# EAGLE board rev01 (EAGLE 7.3.0), part 1 of 2
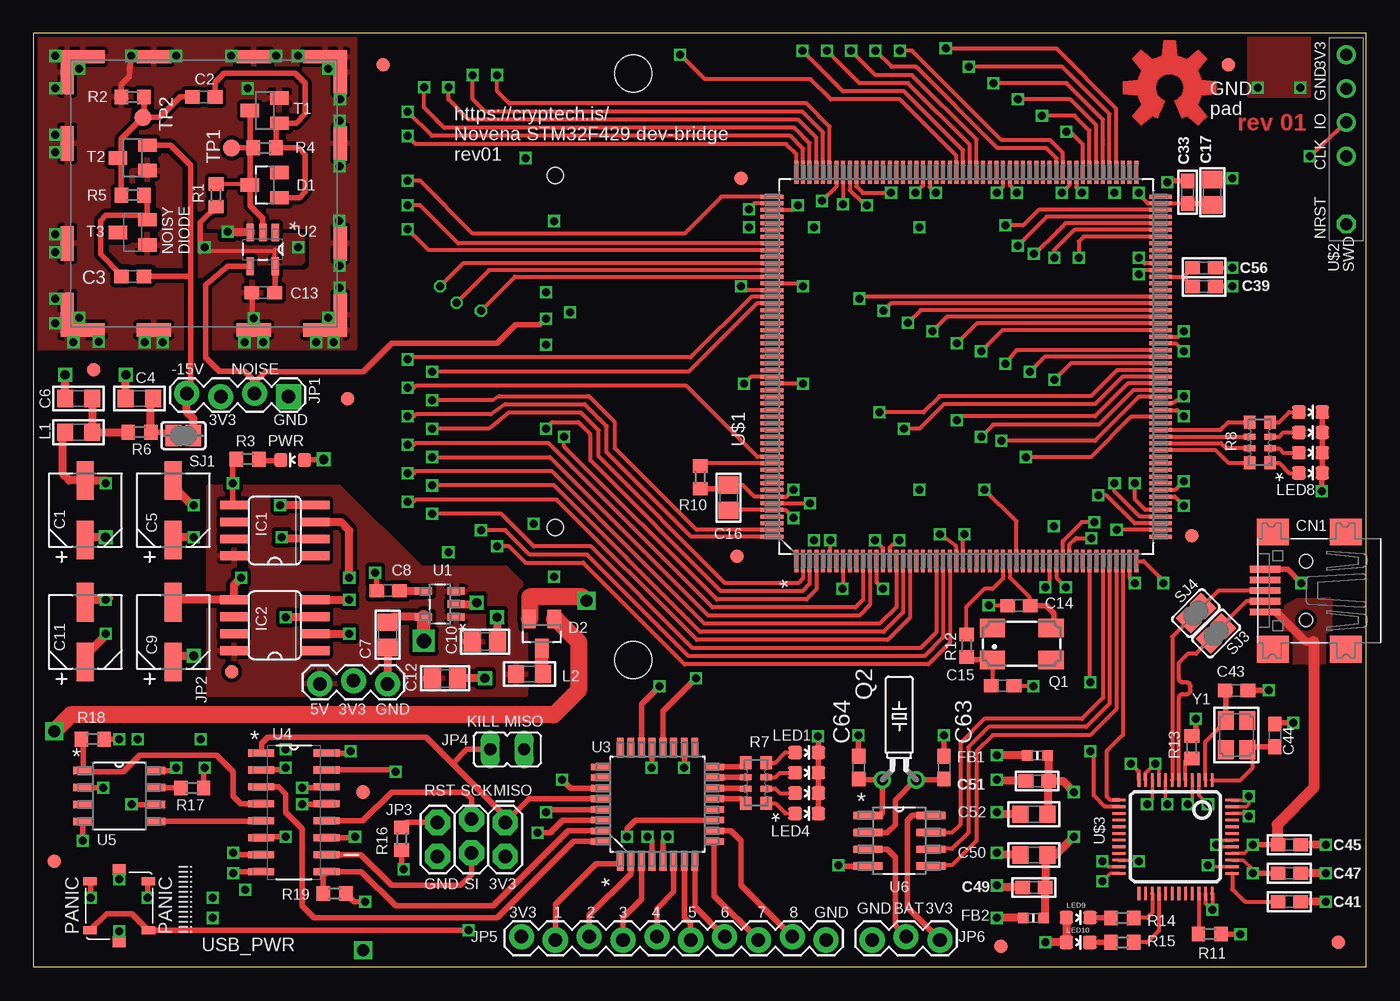
[diagram p8: board, top side]
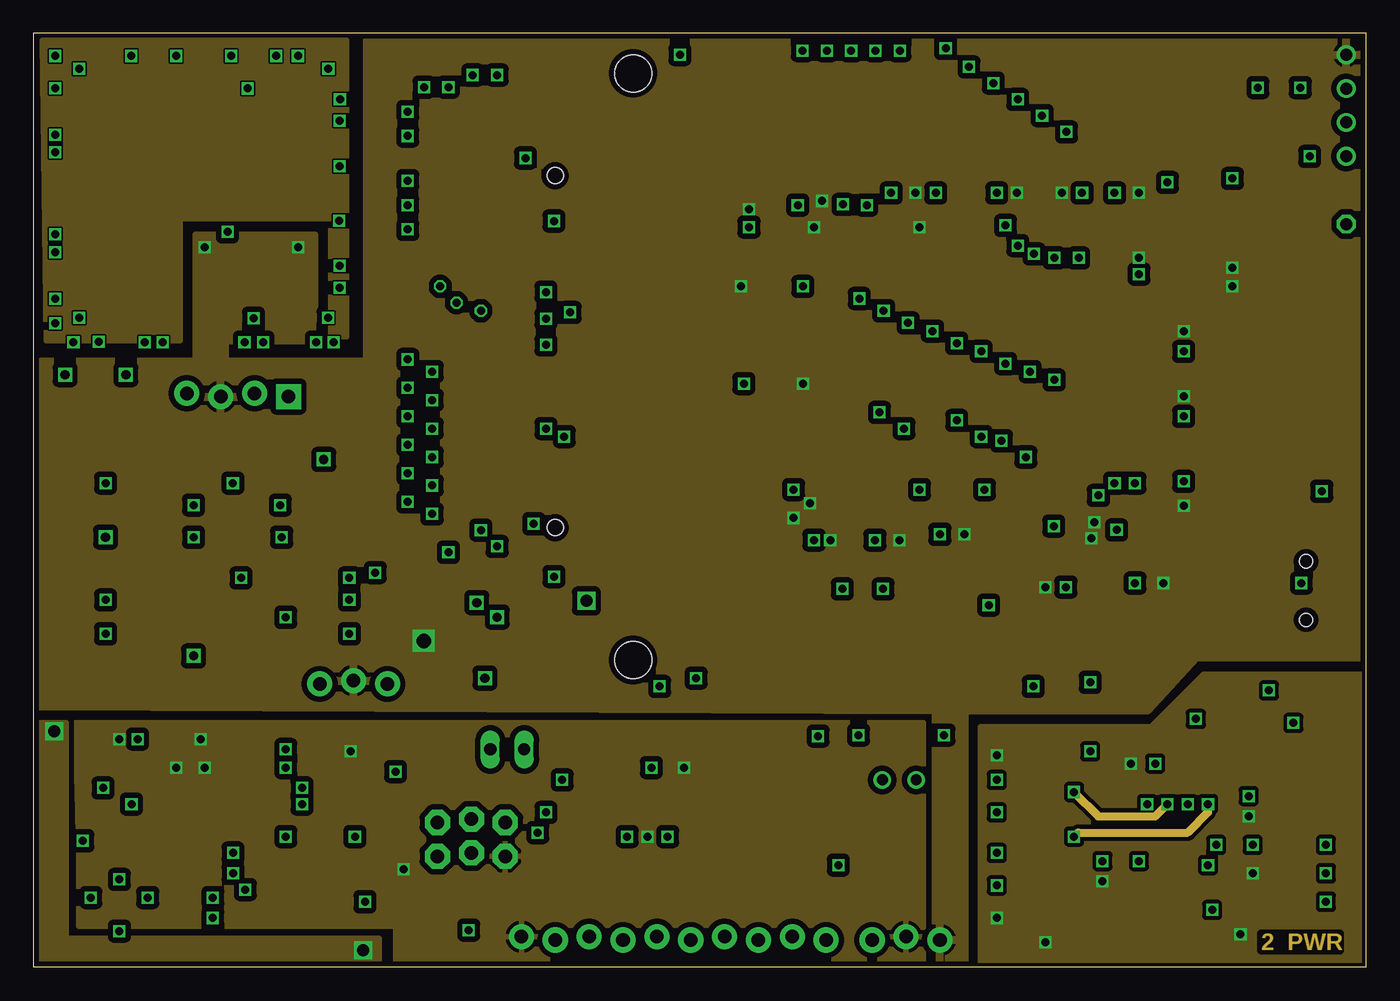
[diagram p9: board, inner layer POWER]
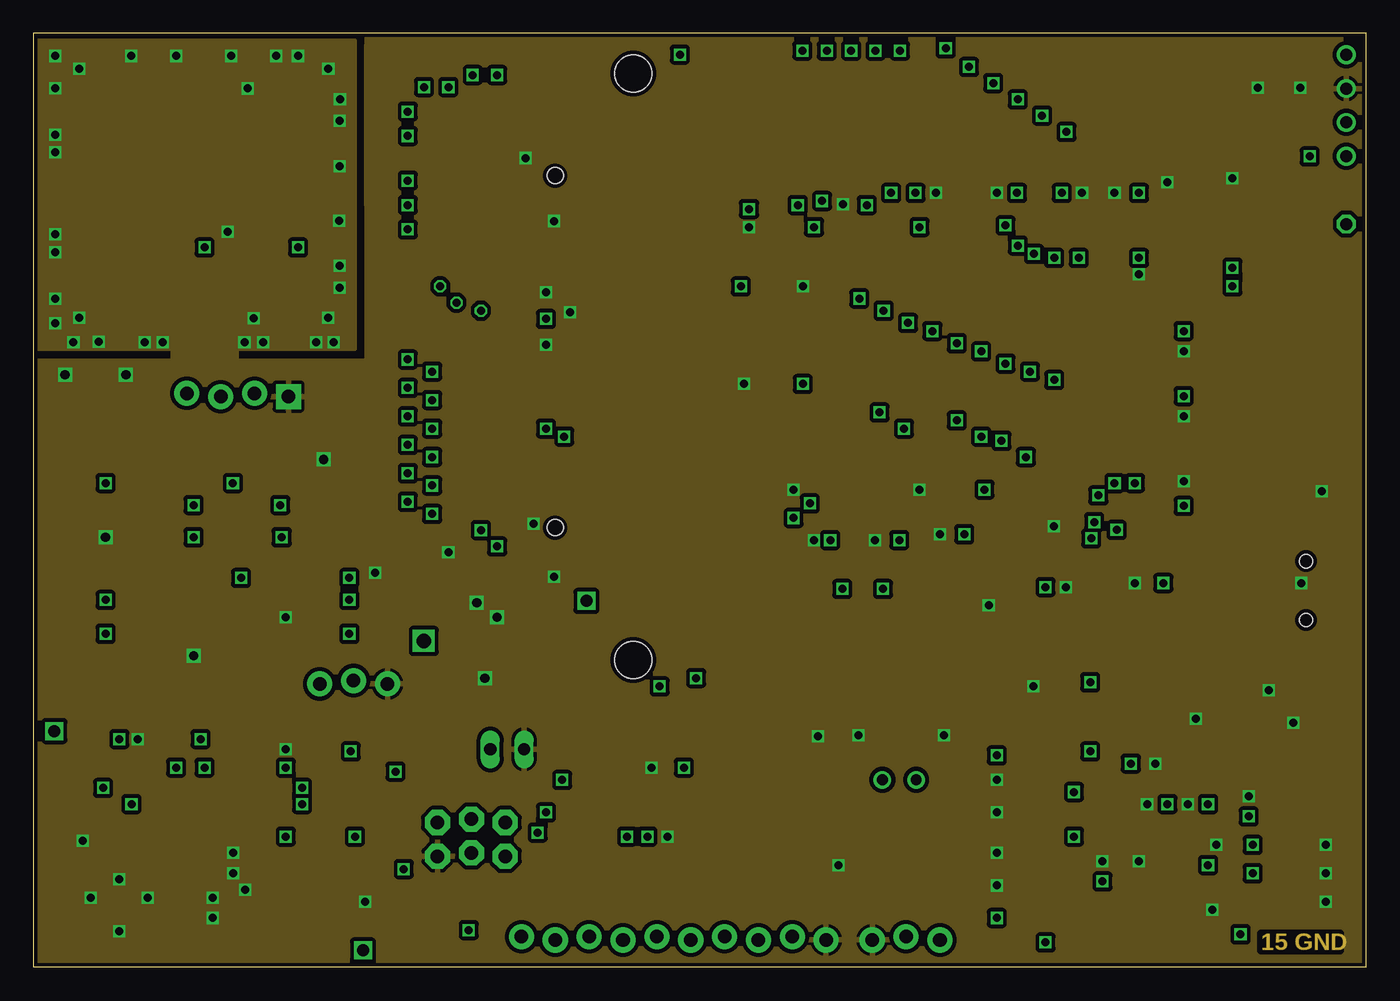
[diagram p10: board, inner layer GND]
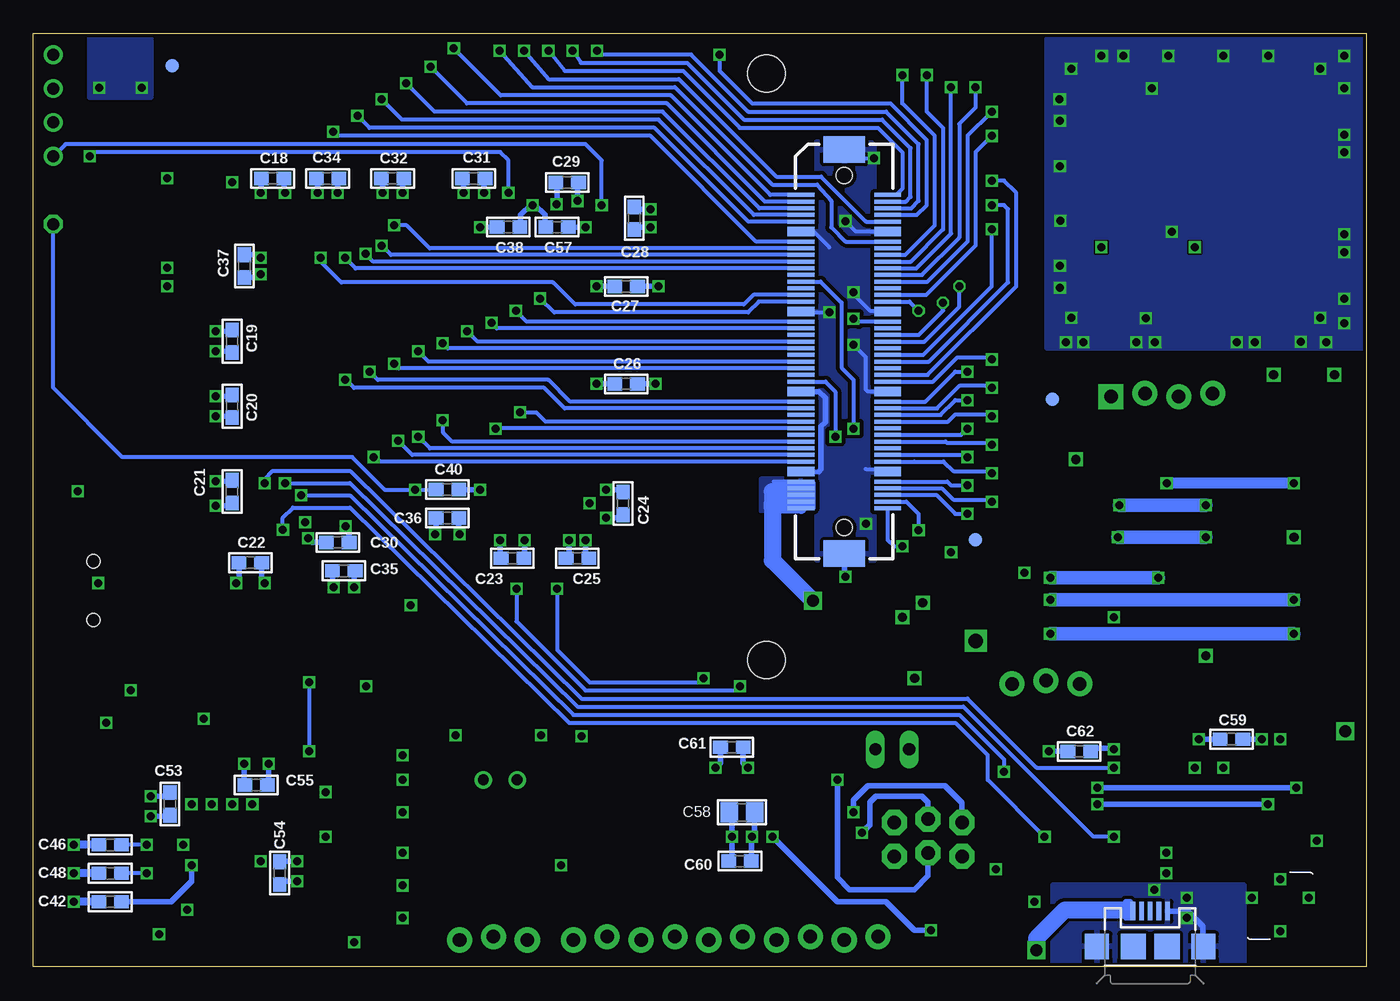
[diagram p11: board, bottom side, seen from below]

Size 100 x 70 mm. Coordinates in mm from the lower left corner, seen from the top.
Outline: 100,70 0,70 0,0 100,0 100,70
Copper layers (1*2*15*16): Top 0.035mm / dielectric 0.2mm / POWER 0.01706875mm / dielectric 1.2mm / GND 0.01706875mm / dielectric 0.2mm / Bottom 0.035mm
Design rules "dirt_cheap_dirty_boards.v1.FOUR_LAYERS": minimum track width 5mil, minimum drill 12mil, track to track 5mil, track to pad 5mil, pad to pad 5mil, via to via 5mil, smd to smd 0mil, copper to edge 10mil, drill to drill 10mil, minimum pad ring 10mil, minimum via ring 6mil, stop-mask expansion 2mil, vias tented up to drill 25mil, thermal gap 10mil
Net classes: 1 Ground: width 0.203 mm, drill 0.508 mm
Holes 2.8 mm at 45,23 45,67

## Footprints (pad centres in the part's own frame; a part is rotated, then mirrored left to right if it is on the bottom)
CAPAE530X610N_BIG_PADS = smd 2.896 x 1.27: 1 -2.235,0; 2 2.235,0
C0603 = smd 1.1 x 1: 1 -0.85,0; 2 0.85,0
_0805 = smd 1.2 x 1.3: 1 -1.016,0; 2 1.016,0
0805 = smd 1.3 x 1.5: 1 -0.95,0; 2 0.95,0
0603 = smd 1.1 x 1: 1 -0.85,0; 2 0.85,0
USB-MINIB = smd 0.5 x 2.308: D+ 0,4.064; D- -0.8,4.064; GND 1.6,4.064; ID 0.8,4.064; VBUS -1.6,4.064 | smd 2 x 2.4: GND1 -4.4,-2; GND2 -4.4,3.5; GND3 4.4,3.5; GND4 4.4,-2 | hole 1: -2.2,1; 2.2,1
FX10A-80P/8-SV(71) = smd 0.3 x 2 bottom: 1_F_DX0 11.48,-3.25; 2_F_DX3 10.98,-3.25; 3_F_DX2 10.48,-3.25; 4_F_DX11 9.98,-3.25; 5_DDC_SDA 9.48,-3.25; 6_F_LVDS11_P 7.98,-3.25; 7_F_LVDS11_N 7.48,-3.25; 8_F_DX1 6.98,-3.25; 9_F_LVDSC_N 6.48,-3.25; 10_F_LVDSC_P 5.98,-3.25; 11_GND 5.48,-3.25; 12_F_DX17 4.98,-3.25; 13_GND 4.48,-3.25; 14_F_LVDSB_N 3.98,-3.25; 15_F_LVDSB_P 3.48,-3.25; 16_F_LVDS15_P 1.98,-3.25; 17_F_LVDS15_N 1.48,-3.25; 18_GND 0.98,-3.25; 19_F_LVDS0_P 0.48,-3.25; 20_F_LVDS0_N -0.02,-3.25; 21_GND -0.52,-3.25; 22_F_LVDS_CK1_P -1.02,-3.25; 23_F_LVDS_CK1_N -1.52,-3.25; 24_GND -2.02,-3.25; 25_F_DX14 -2.52,-3.25; 26_F_LVDS4_P -4.02,-3.25; 27_ -4.52,-3.25; 28_GND -5.02,-3.25; 29_ -5.52,-3.25; 30_ -6.02,-3.25; 31_GND -6.52,-3.25; 32_ -7.02,-3.25; 33_ -7.52,-3.25; 34_ -8.02,-3.25; 35_ -8.52,-3.25; 36_P-5.0V_MAIN -10.02,-3.25; 37_P-5.0V_MAIN -10.52,-3.25; 38_P-5.0V_MAIN -11.02,-3.25; 39_P-5.0V_MAIN -11.52,-3.25; 40_P-5.0V_MAIN -12.02,-3.25; 41_F_DX13 -12.02,3.25; 42_FDX_6 -11.52,3.25; 43_F_DX12 -11.02,3.25; 44_F_DX7 -10.52,3.25; 45_F_DX15 -10.02,3.25; 46_F_LVDS7_N -8.52,3.25; 47_F_LVDS7_P -8.02,3.25; 48_GND -7.52,3.25; 49_ -7.02,3.25; 50_ -6.52,3.25; 51_GND -6.02,3.25; 52_ -5.52,3.25; 53_ -5.02,3.25; 54_ -4.52,3.25; 55_ -4.02,3.25; 56_ -2.52,3.25; 57_ -2.02,3.25; 58_GND -1.52,3.25; 59_ -1.02,3.25; 60_F_LVDS9_P -0.52,3.25; 61_GND -0.02,3.25; 62_F_LVDS_CK0_N 0.48,3.25; 63_F_LVDS_CK0_P 0.98,3.25; 64_GND 1.48,3.25; 65_F_DX18 1.98,3.25; 66_ 3.48,3.25; 67_ 3.98,3.25; 68_GND 4.48,3.25; 69_ 4.98,3.25; 70_ 5.48,3.25; 71_ 5.98,3.25; 72_ 6.48,3.25; 73_ 6.98,3.25; 74_GND 7.48,3.25; 75_ 7.98,3.25; 76_ 9.48,3.25; 77_ 9.98,3.25; 78_DDC_SCL 10.48,3.25; 79_ 10.98,3.25; 80_ 11.48,3.25 | smd 0.7 x 2 bottom: GND1 8.73,-3.25; GND2 2.73,-3.25; GND3 -3.27,-3.25; GND4 -9.27,-3.25; GND5 -9.27,3.25; GND6 -3.27,3.25; GND7 2.73,3.25; GND8 8.73,3.25 | smd 2 x 3.1 bottom: GUIDE@L 14.88,0; GUIDE@R -15.42,0 | hole 1.2: -13.47,0; 12.93,0
SOT23 = smd 1 x 1.4: 1 -0.95,-1.1; 2 0.95,-1.1; 3 0,1.1
_0603MP = smd 0.8 x 0.8: 1 -0.762,0; 2 0.762,0
FIDUCIAL-1X2 = smd 1 x 1: 1 0,0
SO08 = smd 0.66 x 2.032: 1 -1.905,-3.073; 2 -0.635,-3.073; 3 0.635,-3.073; 4 1.905,-3.073; 5 1.905,3.073; 6 0.635,3.073; 7 -0.635,3.073; 8 -1.905,3.073
1X04_LOCK = drill 1.016 pad 1.88 square: 1 0,0.127 | drill 1.016 pad 1.88: 2 2.54,-0.127; 3 5.08,0.127; 4 7.62,-0.127
1X03_LOCK = drill 1.016 pad 1.88: 1 0,0.127; 2 2.54,-0.127; 3 5.08,0.127
2X3_LOCK = drill 1.016 pad 1.88 octagon: 1 0,0; 2 0,2.54; 3 2.54,-0.254; 4 2.54,2.286; 5 5.08,0; 6 5.08,2.54
JP1 = drill 0.914 long: 1 0,-1.27; 2 0,1.27
1X10_LOCK = drill 1.016 pad 1.88: 1 0,0.127; 2 2.54,-0.127; 3 5.08,0.127; 4 7.62,-0.127; 5 10.16,0.127; 6 12.7,-0.127; 7 15.24,0.127; 8 17.78,-0.127; 9 20.32,0.127; 10 22.86,-0.127
LED-0603 = smd 1 x 1: A 0,-0.877; C 0,0.877
CTS406 = smd 1.9 x 1.4: 1 -2.2,-1.2; 2 2.2,-1.2; 3 2.2,1.2; 4 -2.2,1.2
TC26H = drill 0.813: 1 -1.27,0; 2 1.27,0
R0603 = smd 1 x 1.1: 1 -0.85,0; 2 0.85,0
RESCAXE80P320X160X60-8N = smd 0.864 x 0.965: 1 -0.762,1.524; 4 -0.762,-1.524; 5 0.762,-1.524; 8 0.762,1.524 | smd 0.864 x 0.457: 2 -0.762,0.432; 3 -0.762,-0.432; 6 0.762,-0.432; 7 0.762,0.432
WE-SHC_36103205_NO_CREAM = smd 3.3 x 1: 1 10.37,10.25; 6 10.37,-10.25; 9 -7.83,-10.25; 14 -7.83,10.25 | smd 1 x 3.3: 2 11.52,9.1; 5 11.52,-9.1; 10 -8.98,-9.1; 13 -8.98,9.1 | smd 1 x 2.6: 3 11.52,3.75; 4 11.52,-3.75; 11 -8.98,-3.75; 12 -8.98,3.75 | smd 2.6 x 1: 7 5.02,-10.25; 8 -2.48,-10.25; 15 -2.48,10.25; 16 5.02,10.25
SOLDERJUMPER_CLOSEDWIRE@1 = smd 1.168 x 1.6: 1 -0.762,0; 2 0.762,0 | smd 1.016 x 0.508: WIRE 0,0
SOLDERJUMPER_CLOSEDWIRE = smd 1.168 x 1.6: 1 -0.762,0; 2 0.762,0 | smd 0.61 x 0.305: WIRE 0,0
SOT23-BEC = smd 1 x 1.4: B -0.95,-1.1; C 0,1.1; E 0.95,-1.1
B1,27 = smd 1.27 x 1.27: TP 0,0
SOT95P300X120-5N = smd 1.27 x 0.559: 1 -1.219,0.965; 2 -1.219,0; 3 -1.219,-0.965; 4 1.219,-0.965; 5 1.219,0.965
SOT95P275X110-5N = smd 1.321 x 0.559: 1 -1.27,0.94; 2 -1.27,0; 3 -1.27,-0.94; 4 1.27,-0.94; 5 1.27,0.94
QFP80P900X900X120-32N = smd 1.473 x 0.508: 1 -4.242,2.794; 2 -4.242,2.007; 3 -4.242,1.194; 4 -4.242,0.406; 5 -4.242,-0.406; 6 -4.242,-1.194; 7 -4.242,-2.007; 8 -4.242,-2.794; 17 4.242,-2.794; 18 4.242,-2.007; 19 4.242,-1.194; 20 4.242,-0.406; 21 4.242,0.406; 22 4.242,1.194; 23 4.242,2.007; 24 4.242,2.794 | smd 0.508 x 1.473: 9 -2.794,-4.242; 10 -2.007,-4.242; 11 -1.194,-4.242; 12 -0.406,-4.242; 13 0.406,-4.242; 14 1.194,-4.242; 15 2.007,-4.242; 16 2.794,-4.242; 25 2.794,4.242; 26 2.007,4.242; 27 1.194,4.242; 28 0.406,4.242; 29 -0.406,4.242; 30 -1.194,4.242; 31 -2.007,4.242; 32 -2.794,4.242
SOIC127P600X175-16N = smd 1.956 x 0.533: 1 -2.464,4.445; 2 -2.464,3.175; 3 -2.464,1.905; 4 -2.464,0.635; 5 -2.464,-0.635; 6 -2.464,-1.905; 7 -2.464,-3.175; 8 -2.464,-4.445; 9 2.464,-4.445; 10 2.464,-3.175; 11 2.464,-1.905; 12 2.464,-0.635; 13 2.464,0.635; 14 2.464,1.905; 15 2.464,3.175; 16 2.464,4.445
SOIC127P600X175-8N = smd 1.473 x 0.559: 1 -2.718,1.905; 2 -2.718,0.635; 3 -2.718,-0.635; 4 -2.718,-1.905; 5 2.718,-1.905; 6 2.718,-0.635; 7 2.718,0.635; 8 2.718,1.905
SOIC127P600X175-8N' = smd 2.184 x 0.559: 1 -2.362,1.905; 2 -2.362,0.635; 3 -2.362,-0.635; 4 -2.362,-1.905; 5 2.362,-1.905; 6 2.362,-0.635; 7 2.362,0.635; 8 2.362,1.905
LQFP-208 = smd 1.7 x 0.3: 1 -14.58,12.751; 2 -14.58,12.243; 3 -14.58,11.76; 4 -14.58,11.252; 5 -14.58,10.744; 6 -14.58,10.262; 7 -14.58,9.754; 8 -14.58,9.246; 9 -14.58,8.738; 10 -14.58,8.255; 11 -14.58,7.747; 12 -14.58,7.239; 13 -14.58,6.756; 14 -14.58,6.248; 15 -14.58,5.74; 16 -14.58,5.258; 17 -14.58,4.75; 18 -14.58,4.242; 19 -14.58,3.759; 20 -14.58,3.251; 21 -14.58,2.743; 22 -14.58,2.261; 23 -14.58,1.753; 24 -14.58,1.245; 25 -14.58,0.762; 26 -14.58,0.254; 27 -14.58,-0.254; 28 -14.58,-0.762; 29 -14.58,-1.245; 30 -14.58,-1.753; 31 -14.58,-2.261; 32 -14.58,-2.743; 33 -14.58,-3.251; 34 -14.58,-3.759; 35 -14.58,-4.242; 36 -14.58,-4.75; 37 -14.58,-5.258; 38 -14.58,-5.74; 39 -14.58,-6.248; 40 -14.58,-6.756; 41 -14.58,-7.239; 42 -14.58,-7.747; 43 -14.58,-8.255; 44 -14.58,-8.738; 45 -14.58,-9.246; 46 -14.58,-9.754; 47 -14.58,-10.262; 48 -14.58,-10.744; 49 -14.58,-11.252; 50 -14.58,-11.76; 51 -14.58,-12.243; 52 -14.58,-12.751; 105 14.58,-12.751; 106 14.58,-12.243; 107 14.58,-11.76; 108 14.58,-11.252; 109 14.58,-10.744; 110 14.58,-10.262; 111 14.58,-9.754; 112 14.58,-9.246; 113 14.58,-8.738; 114 14.58,-8.255; 115 14.58,-7.747; 116 14.58,-7.239; 117 14.58,-6.756; 118 14.58,-6.248; 119 14.58,-5.74; 120 14.58,-5.258; 121 14.58,-4.75; 122 14.58,-4.242; 123 14.58,-3.759; 124 14.58,-3.251; 125 14.58,-2.743; 126 14.58,-2.261; 127 14.58,-1.753; 128 14.58,-1.245; 129 14.58,-0.762; 130 14.58,-0.254; 131 14.58,0.254; 132 14.58,0.762; 133 14.58,1.245; 134 14.58,1.753; 135 14.58,2.261; 136 14.58,2.743; 137 14.58,3.251; 138 14.58,3.759; 139 14.58,4.242; 140 14.58,4.75; 141 14.58,5.258; 142 14.58,5.74; 143 14.58,6.248; 144 14.58,6.756; 145 14.58,7.239; 146 14.58,7.747; 147 14.58,8.255; 148 14.58,8.738; 149 14.58,9.246; 150 14.58,9.754; 151 14.58,10.262; 152 14.58,10.744; 153 14.58,11.252; 154 14.58,11.76; 155 14.58,12.243; 156 14.58,12.751 | smd 0.3 x 1.7: 53 -12.751,-14.58; 54 -12.243,-14.58; 55 -11.76,-14.58; 56 -11.252,-14.58; 57 -10.744,-14.58; 58 -10.262,-14.58; 59 -9.754,-14.58; 60 -9.246,-14.58; 61 -8.738,-14.58; 62 -8.255,-14.58; 63 -7.747,-14.58; 64 -7.239,-14.58; 65 -6.756,-14.58; 66 -6.248,-14.58; 67 -5.74,-14.58; 68 -5.258,-14.58; 69 -4.75,-14.58; 70 -4.242,-14.58; 71 -3.759,-14.58; 72 -3.251,-14.58; 73 -2.743,-14.58; 74 -2.261,-14.58; 75 -1.753,-14.58; 76 -1.245,-14.58; 77 -0.762,-14.58; 78 -0.254,-14.58; 79 0.254,-14.58; 80 0.762,-14.58; 81 1.245,-14.58; 82 1.753,-14.58; 83 2.261,-14.58; 84 2.743,-14.58; 85 3.251,-14.58; 86 3.759,-14.58; 87 4.242,-14.58; 88 4.75,-14.58; 89 5.258,-14.58; 90 5.74,-14.58; 91 6.248,-14.58; 92 6.756,-14.58; 93 7.239,-14.58; 94 7.747,-14.58; 95 8.255,-14.58; 96 8.738,-14.58; 97 9.246,-14.58; 98 9.754,-14.58; 99 10.262,-14.58; 100 10.744,-14.58; 101 11.252,-14.58; 102 11.76,-14.58; 103 12.243,-14.58; 104 12.751,-14.58; 157 12.751,14.58; 158 12.243,14.58; 159 11.76,14.58; 160 11.252,14.58; 161 10.744,14.58; 162 10.262,14.58; 163 9.754,14.58; 164 9.246,14.58; 165 8.738,14.58; 166 8.255,14.58; 167 7.747,14.58; 168 7.239,14.58; 169 6.756,14.58; 170 6.248,14.58; 171 5.74,14.58; 172 5.258,14.58; 173 4.75,14.58; 174 4.242,14.58; 175 3.759,14.58; 176 3.251,14.58; 177 2.743,14.58; 178 2.261,14.58; 179 1.753,14.58; 180 1.245,14.58; 181 0.762,14.58; 182 0.254,14.58; 183 -0.254,14.58; 184 -0.762,14.58; 185 -1.245,14.58; 186 -1.753,14.58; 187 -2.261,14.58; 188 -2.743,14.58; 189 -3.251,14.58; 190 -3.759,14.58; 191 -4.242,14.58; 192 -4.75,14.58; 193 -5.258,14.58; 194 -5.74,14.58; 195 -6.248,14.58; 196 -6.756,14.58; 197 -7.239,14.58; 198 -7.747,14.58; 199 -8.255,14.58; 200 -8.738,14.58; 201 -9.246,14.58; 202 -9.754,14.58; 203 -10.262,14.58; 204 -10.744,14.58; 205 -11.252,14.58; 206 -11.76,14.58; 207 -12.243,14.58; 208 -12.751,14.58
100MIL_THT = drill 0.9: P$GND 0,-5.08; P$SWDCLK 0,0; P$SWDIO 0,-2.54; P$VCC 0,-7.62 | drill 0.9 octagon: P$NRST 0,5.08
FT2323HL_LQFP48 = smd 0.2 x 1: 1 -2.75,-4.25; 2 -2.25,-4.25; 3 -1.75,-4.25; 4 -1.25,-4.25; 5 -0.75,-4.25; 6 -0.25,-4.25; 7 0.25,-4.25; 8 0.75,-4.25; 9 1.25,-4.25; 10 1.75,-4.25; 11 2.25,-4.25; 12 2.75,-4.25; 25 2.75,4.25; 26 2.25,4.25; 27 1.75,4.25; 28 1.25,4.25; 29 0.75,4.25; 30 0.25,4.25; 31 -0.25,4.25; 32 -0.75,4.25; 33 -1.25,4.25; 34 -1.75,4.25; 35 -2.25,4.25; 36 -2.75,4.25 | smd 1 x 0.2: 13 4.25,-2.75; 14 4.25,-2.25; 15 4.25,-1.75; 16 4.25,-1.25; 17 4.25,-0.75; 18 4.25,-0.25; 19 4.25,0.25; 20 4.25,0.75; 21 4.25,1.25; 22 4.25,1.75; 23 4.25,2.25; 24 4.25,2.75; 37 -4.25,2.75; 38 -4.25,2.25; 39 -4.25,1.75; 40 -4.25,1.25; 41 -4.25,0.75; 42 -4.25,0.25; 43 -4.25,-0.25; 44 -4.25,-0.75; 45 -4.25,-1.25; 46 -4.25,-1.75; 47 -4.25,-2.25; 48 -4.25,-2.75
TACTILE_SWITCH = smd 0.6 x 1: A1 -1.85,2.2; A2 -1.85,-2.2; B1 1.85,2.2; B2 1.85,-2.2 | smd 0.8 x 1: G1 -2.7,0; G2 2.7,0
USB-MICROB = smd 0.35 x 1.4: D+ 0,2.65; D- -0.65,2.65; GND 1.3,2.65; ID 0.65,2.65; VBUS -1.3,2.65 | smd 1.8 x 1.9: MT1 -4,0; MT2 4,0 | smd 1.9 x 1.9: P$1 -1.27,0; P$2 1.27,0
CRYSTAL_3.2X2.5 = smd 1.4 x 1.2: 1 -1.1,-0.8; 2 1.1,0.8; GND1 -1.1,0.8; GND2 1.1,-0.8

## Placement (x,y rotation side)
C1  10uF  [CAPAE530X610N_BIG_PADS]  3.9,34.24 90 top
C2  0.1µF  [C0603]  12.79,65.23 0 top
C3  0.1µF  [C0603]  7.46,51.77 180 top
C4  10 uF X5R 25v  [_0805]  7.96,42.62 180 top
C5  10uF  [CAPAE530X610N_BIG_PADS]  10.5,34.24 90 top
C6  10 uF X5R 25v  [_0805]  3.39,42.62 180 top
C7  1.0 uF X7R  [0805]  26.58,24.88 270 top
C8  10NF C0G  [C0603]  26.62,28.2 0 top
C9  10uF  [CAPAE530X610N_BIG_PADS]  10.5,25.1 90 top
C10  1.0 uF X7R  [0805]  33.88,24.38 0 top
C11  10uF  [CAPAE530X610N_BIG_PADS]  3.9,25.1 90 top
C12  10 uF X7R 25v  [0805]  30.88,21.62 0 top
C13  0.1µF  [C0603]  17.26,50.55 0 top
C14  10 pF  [C0603]  73.94,27.07 0 top
C15  10 pF  [C0603]  72.72,21.07 180 top
C16  10 uF X7R 10v  [0805]  52.17,35.18 90 top
C17  10 uF X7R 10v  [0805]  88.44,58.08 90 top
C18  0.1uF  [0603]  82.04,59.12 0 bottom
C19  0.1uF  [0603]  85.09,46.91 270 bottom
C20  0.1uF  [0603]  85.09,42.03 270 bottom
C21  0.1uF  [0603]  85.09,35.63 90 bottom
C22  0.1uF  [0603]  83.72,30.3 0 bottom
C23  0.1uF  [0603]  64.06,30.63 0 bottom
C24  0.1uF  [0603]  55.75,34.74 90 bottom
C25  0.1uF  [0603]  59.18,30.63 0 bottom
C26  0.1uF  [0603]  55.52,43.71 0 bottom
C27  0.1uF  [0603]  55.52,51.02 180 bottom
C28  0.1uF  [0603]  54.91,56.13 270 bottom
C29  0.1uF  [0603]  59.94,58.82 180 bottom
C30  1 uF X7R 10v  [0603]  77.16,31.82 0 bottom
C31  0.1uF  [0603]  66.95,59.12 180 bottom
C32  0.1uF  [0603]  73.05,59.12 0 bottom
C33  0.1uF  [0603]  86.61,58.08 90 top
C34  0.1uF  [0603]  77.92,59.12 180 bottom
C35  0.1uF  [0603]  76.71,29.69 180 bottom
C36  0.1uF  [0603]  68.93,33.65 0 bottom
C37  0.1uF  [0603]  84.17,52.55 270 bottom
C38  2.2 uF LowESR  [0603]  64.36,55.47 0 bottom
C39  2.2 uF LowESR  [0603]  87.83,51.02 180 top
C40  0.1uF  [0603]  68.93,35.78 0 bottom
C41  0.1 uF X7R 10v  [0603]  94.23,4.87 0 top
C42  0.1 uF X7R 10v  [0603]  94.23,4.87 180 bottom
C43  5 pF  [C0603]  90.27,20.72 180 top
C44  5 pF  [C0603]  93.15,17.34 270 top
C45  4.7 uF X7R 10v  [0603]  94.23,9.14 0 top
C46  0.1 uF X7R 10v  [0603]  94.23,9.14 180 bottom
C47  4.7 uF X7R 10v  [0603]  94.23,7 0 top
C48  0.1 uF X7R 10v  [0603]  94.23,7 180 bottom
C49  0.1 uF X7R 10v  [0603]  75.07,5.95 180 top
C50  10 uF X7R 10v  [_0805]  75.07,8.39 180 top
C51  0.1 uF X7R 10v  [0603]  75.31,13.93 180 top
C52  10 uF X7R 10v  [_0805]  75.07,11.43 180 top
C53  0.1uF  [0603]  89.74,12.2 90 bottom
C54  0.1uF  [0603]  81.51,7.02 90 bottom
C55  0.1uF  [0603]  83.28,13.63 180 bottom
C56  2.2 uF LowESR  [0603]  87.83,52.42 180 top
C57  2.2 uF LowESR  [0603]  60.7,55.47 180 bottom
C58  10 uF X7R 10v  [0805]  46.83,11.58 180 bottom
C59  0.1 uF X7R 10v  [0603]  10.11,17.06 0 bottom
C60  0.1 uF X7R 10v  [0603]  46.99,7.92 180 bottom
C61  0.1 uF X7R 10v  [0603]  47.6,16.45 0 bottom
C62  0.1 uF X7R 10v  [0603]  21.54,16.15 0 bottom
C63  5pF  [C0603]  68.32,14.93 270 top
C64  5pF  [C0603]  61.92,14.93 270 top
CN1  HOST  [USB-MINIB]  96.48,28.21 90 top
CON1  FX10-80S/8-SV(71)  [FX10A-80P/8-SV(71)]  39.15,46.4 90 top
D1  BAT54  [SOT23]  17.36,58.62 90 top
D2  BAT54C  [SOT23]  38.15,24.99 180 top
FB1  600R 500mA  [_0603MP]  75.33,15.84 0 top
FB2  600R 500mA  [_0603MP]  75.03,3.65 0 top
FID1  FIDUCIAL1X2  [FIDUCIAL-1X2]  14.87,22.13 90 top
FID2  FIDUCIAL1X2  [FIDUCIAL-1X2]  23.58,42.58 90 top
FID3  FIDUCIAL1X2  [FIDUCIAL-1X2]  4.52,44.78 90 top
FID4  FIDUCIAL1X2  [FIDUCIAL-1X2]  23.56,42.57 270 bottom
FID5  FIDUCIAL1X2  [FIDUCIAL-1X2]  29.32,32.03 270 bottom
FID6  FIDUCIAL1X2  [FIDUCIAL-1X2]  89.59,67.56 0 bottom
FID7  FIDUCIAL1X2  [FIDUCIAL-1X2]  24.74,13.1 0 top
FID8  FIDUCIAL1X2  [FIDUCIAL-1X2]  53.08,59.12 0 top
FID9  FIDUCIAL1X2  [FIDUCIAL-1X2]  86.92,32.3 0 top
FID10  FIDUCIAL1X2  [FIDUCIAL-1X2]  89.66,67.66 0 top
FID11  FIDUCIAL1X2  [FIDUCIAL-1X2]  72.59,1.52 0 top
FID12  FIDUCIAL1X2  [FIDUCIAL-1X2]  52.78,30.78 0 top
FID13  FIDUCIAL1X2  [FIDUCIAL-1X2]  1.57,7.92 0 top
FID14  FIDUCIAL1X2  [FIDUCIAL-1X2]  26.26,67.66 0 top
FID15  FIDUCIAL1X2  [FIDUCIAL-1X2]  97.89,1.82 0 top
IC1  ICL7660CSA  [SO08]  18.12,32.72 90 top
IC2  ICL7660CSA  [SO08]  18.12,25.6 90 top
JP1  VOLTS  [1X04_LOCK]  19.14,42.88 180 top
JP2  VCC  [1X03_LOCK]  26.57,21.33 180 top
JP3  AVR_SPI_PRG_62X3_LOCK  [2X3_LOCK]  35.4,10.81 180 top
JP4  [JP1]  35.56,16.3 90 top
JP5  [1X10_LOCK]  36.62,2.13 0 top
JP6  [1X03_LOCK]  68.02,2.13 180 top
L1  10uH  [_0805]  3.39,40.08 0 top
L2  10uH  [_0805]  37.23,21.94 180 top
LED1  B  [LED-0603]  58.03,16.06 270 top
LED2  G  [LED-0603]  58.03,14.54 270 top
LED3  Y  [LED-0603]  58.03,13.02 270 top
LED4  R  [LED-0603]  58.03,11.49 270 top
LED5  B  [LED-0603]  95.83,41.59 270 top
LED6  G  [LED-0603]  95.83,40.07 270 top
LED7  Y  [LED-0603]  95.83,38.54 270 top
LED8  R  [LED-0603]  95.83,37.02 270 top
LED9  Y  [LED-0603]  78.39,3.69 270 top
LED10  G  [LED-0603]  78.38,1.82 270 top
LOGO1  OSHW-LOGOL-COPPER  [OSHW-LOGO-L_COPPER]  85.26,65.92 0 top
ORANGE  [LED-0603]  19.45,38.01 90 top
Q1  25MHz  [CTS406]  74.16,24.2 0 top
Q2  32768  [TC26H]  64.97,14.01 0 top
R1  1K  [R0603]  13.72,57.85 270 top
R2  1K  [R0603]  7.46,65.23 0 top
R3  10K  [R0603]  16.08,38.06 180 top
R4  10K  [R0603]  17.36,61.42 180 top
R5  470  [R0603]  7.46,57.86 0 top
R6  0  [R0603]  7.96,40.08 180 top
R7  330R  [RESCAXE80P320X160X60-8N]  54.22,13.78 180 top
R8  330R  [RESCAXE80P320X160X60-8N]  92.02,39.31 180 top
R10  10K  [R0603]  50.04,36.7 90 top
R11  10K  [R0603]  88.26,2.44 0 top
R12  0  [R0603]  70.02,24.07 270 top
R13  12K 1%  [R0603]  86.92,16.45 90 top
R14  220  [R0603]  81.7,3.66 0 top
R15  220  [R0603]  81.7,1.83 0 top
R16  15K  [R0603]  27.63,9.59 270 top
R17  15K  [R0603]  11.94,13.4 180 top
R18  15K  [R0603]  4.47,17.06 0 top
R19  15K  [R0603]  22.6,5.48 180 top
S1  SHIELDING CABINET  [WE-SHC_36103205_NO_CREAM]  11.52,58 0 top
SJ1  [SOLDERJUMPER_CLOSEDWIRE@1]  11.27,39.83 180 top
SJ3  [SOLDERJUMPER_CLOSEDWIRE]  88.74,24.99 225 top
SJ4  [SOLDERJUMPER_CLOSEDWIRE]  87.22,26.51 225 top
T1  BC847  [SOT23]  17.36,64.21 90 top
T2  BC847  [SOT23]  7.46,60.66 90 top
T3  BC818  [SOT23-BEC]  7.46,55.07 90 top
TP1  TPB1,27  [B1,27]  14.87,61.42 90 top
TP2  TPB1,27  [B1,27]  8.22,63.7 90 top
U1  LP3985IM5-3.3  [SOT95P300X120-5N]  30.51,27.2 180 top
U2  MC74HC1G14DTT1G  [SOT95P275X110-5N]  17.21,53.8 270 top
U3  ATTINY828R-AU  [QFP80P900X900X120-32N]  46.83,12.19 90 top
U4  MC14551BDG  [SOIC127P600X175-16N]  19.56,11.58 0 top
U5  23K640-I/SN  [SOIC127P600X175-8N]  6.45,12.8 0 top
U6  MCP79412-I/SN  [SOIC127P600X175-8N']  64.97,9.44 0 top
U$1  STM32F429BIT6  [LQFP-208]  70,45 90 top
U$2  STM32-SWD  [100MIL_THT]  98.5,60.78 180 top
U$3  FT232H_SERIAL  [FT2323HL_LQFP48]  85.7,9.75 180 top
U$4  TACTILE_SWITCH  [TACTILE_SWITCH]  6.45,4.57 90 top
USB_PWR  USB-MICROB  [USB-MICROB]  16.2,1.52 0 bottom
Y1  12 MHz +- 30 ppm  [CRYSTAL_3.2X2.5]  90.27,17.37 90 top